# EAGLE design ESP32+PSU (EAGLE 9.6.2)
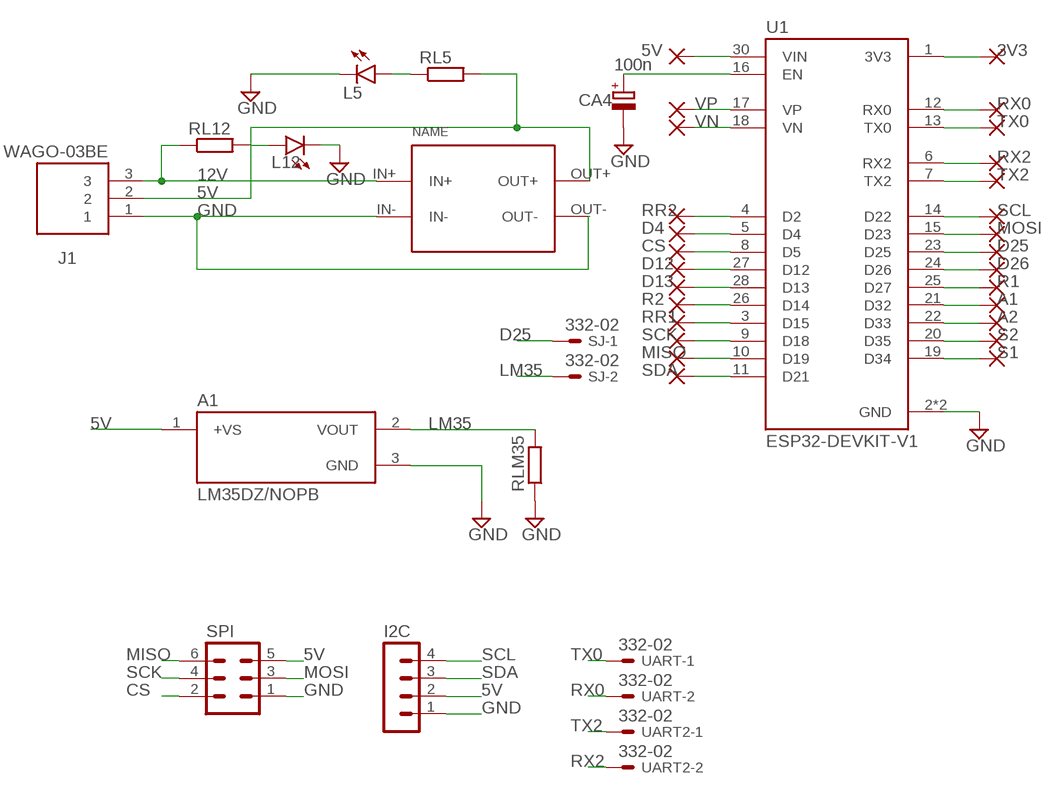
[diagram p0: schematic, sheet 1]

## Parts
A1  LM35DZ/NOPB  [TO92127P521H735-3]
CA4  100n  CPOL-EUE5-6  [E5-6]
I2C  MA04-1  [MA04-1]
J1  WAGO-03BE  [CUI_TB006-508-03BE]
L5  LED3MM  [LED3MM]
L12  LED3MM  [LED3MM]
PAD1  WIREPAD1,6/0,9  [1,6/0,9]
PAD2  WIREPAD1,6/0,9  [1,6/0,9]
PAD3  WIREPAD1,6/0,9  [1,6/0,9]
PAD4  WIREPAD1,6/0,9  [1,6/0,9]
PAD5  WIREPAD1,6/0,9  [1,6/0,9]
PAD6  WIREPAD1,6/0,9  [1,6/0,9]
PAD7  WIREPAD1,6/0,9  [1,6/0,9]
PAD8  WIREPAD1,6/0,9  [1,6/0,9]
PAD9  WIREPAD1,6/0,9  [1,6/0,9]
PAD10  WIREPAD1,6/0,9  [1,6/0,9]
PAD11  WIREPAD1,6/0,9  [1,6/0,9]
PAD12  WIREPAD1,6/0,9  [1,6/0,9]
PAD13  WIREPAD1,6/0,9  [1,6/0,9]
PAD14  WIREPAD1,6/0,9  [1,6/0,9]
PAD15  WIREPAD1,6/0,9  [1,6/0,9]
PAD16  WIREPAD1,6/0,9  [1,6/0,9]
PAD17  WIREPAD1,6/0,9  [1,6/0,9]
PAD18  WIREPAD1,6/0,9  [1,6/0,9]
PAD19  WIREPAD1,6/0,9  [1,6/0,9]
PAD20  WIREPAD1,6/0,9  [1,6/0,9]
PAD21  WIREPAD1,6/0,9  [1,6/0,9]
PAD22  WIREPAD1,6/0,9  [1,6/0,9]
PAD23  WIREPAD1,6/0,9  [1,6/0,9]
PAD24  WIREPAD1,6/0,9  [1,6/0,9]
PAD25  WIREPAD1,6/0,9  [1,6/0,9]
PAD26  WIREPAD1,6/0,9  [1,6/0,9]
PAD52  WIREPAD1,6/0,9  [1,6/0,9]
RL5  R-EU_0309/12  [0309/12]
RL12  R-EU_0309/12  [0309/12]
RLM35  R-EU_0309/12  [0309/12]
SJ  332-02  [332-02]
SPI  MA03-2  [MA03-2]
U1  ESP32-DEVKIT-V1  [MODULE_ESP32_DEVKIT_V1]
U$1  CP8-ADJ  [CP8-ADJ]
UART  332-02  [332-02]
UART2  332-02  [332-02]

## Nets
3V3: PAD11.1(P) U1.1(3V3)
5V: A1.1(+VS) I2C.2 J1.2 PAD25.1(P) RL5.2 SPI.5 U1.30(VIN) U$1.OUT+
12V: J1.3 RL12.1 U$1.IN+
A1: PAD21.1(P) U1.21(D32)
A2: PAD22.1(P) U1.22(D33)
CS: PAD3.1(P) SPI.2 U1.8(D5)
D4: PAD2.1(P) U1.5(D4)
D12: PAD4.1(P) U1.27(D12)
D13: PAD5.1(P) U1.28(D13)
D25: PAD18.1(P) SJ.1 U1.23(D25)
D26: PAD19.1(P) U1.24(D26)
GND: A1.3(GND) CA4.- I2C.1 J1.1 L5.K(C) L12.K(C) RLM35.1 SPI.1 U1.2(GND) U1.29(GND) U$1.IN- U$1.OUT-
LM35: A1.2(VOUT) RLM35.2 SJ.2
MISO: PAD9.1(P) SPI.6 U1.10(D19)
MOSI: PAD17.1(P) SPI.3 U1.15(D23)
N$14: L12.A RL12.2
N$23: L5.A RL5.1
N$25: CA4.+ U1.16(EN)
R1: PAD20.1(P) U1.25(D27)
R2: PAD6.1(P) U1.26(D14)
RR1: PAD7.1(P) U1.3(D15)
RR2: PAD1.1(P) U1.4(D2)
RX0: PAD12.1(P) U1.12(RX0) UART.2
RX2: PAD14.1(P) U1.6(RX2) UART2.2
S1: PAD24.1(P) U1.19(D34)
S2: PAD23.1(P) U1.20(D35)
SCK: PAD8.1(P) SPI.4 U1.9(D18)
SCL: I2C.4 PAD16.1(P) U1.14(D22)
SDA: I2C.3 PAD10.1(P) U1.11(D21)
TX0: PAD13.1(P) U1.13(TX0) UART.1
TX2: PAD15.1(P) U1.7(TX2) UART2.1
VN: PAD52.1(P) U1.18(VN)
VP: PAD26.1(P) U1.17(VP)

## Library data of the parts
A1 = LM35DZ_NOPB:LM35DZ/NOPB; CHECK_PRICES: https://www.snapeda.com/parts/LM35DZ/NOPB/Texas+Instruments/view-part/?ref=eda; DESCRIPTION: 1C high voltage analog temperature sensor, 10 mV/C; DIGIKEY_PART_NUMBER: LM35DZ/NOPB-ND; MF: Texas; MP: LM35DZ/NOPB; PACKAGE: None; SNAPEDA_LINK: https://www.snapeda.com/parts/LM35DZ/NOPB/Texas+Instruments/view-part/?ref=snap
CA4 = rcl-ws:CPOL-EU: POLARIZED CAPACITOR, European symbol; SPICEPREFIX: C
I2C = con-lstb:MA04-1: PIN HEADER; OC_FARNELL: unknown; OC_NEWARK: unknown
J1 = TB006-508-03BE:WAGO-03BE: Check availability <https://pricing.snapeda.com/parts/TB006-508-03BE/Same%20Sky/view-part?ref=eda>; AVAILABILITY: In Stock; CHECK_PRICES: https://www.snapeda.com/parts/TB006-508-03BE/Same+Sky/view-part/?ref=eda; DESCRIPTION: 2~24 Poles, Screw Type, Horizontal, 5.08 Pitch, 26~14 (AWG), Terminal Block Connector; MF: Same Sky; MP: TB006-508-03BE; PACKAGE: None; PRICE: None; SNAPEDA_LINK: https://www.snapeda.com/parts/TB006-508-03BE/Same+Sky/view-part/?ref=snap
L5 L12 = led_WS:LED: LED OSRAM: - CHIPLED LG R971, LG N971, LY N971, LG Q971, LY Q971, LO R971, LY R971 LH N974, LH R974 LS Q976, LO Q976, LY Q976 LO Q996 - Hyper CHIPLED LW Q18S LB Q993, LB Q99A, LB R99A - SideLED LS A670, LO A670, LY A670, LG A670, LP A670 LB A673, LV A673, LT A673, LW A673 LH A674 LY A675 LS A676, LA A676, LO A676, LY A676, LW A676 LS A679, LY A679, LG A679 - Hyper Micro SIDELED® LS Y876, LA Y876, LO Y876, LY Y876 LT Y87S - SmartLED LW L88C, LW L88S LB L89C, LB L89S, LG L890 LS L89K, LO L89K, LY L89K LS L896, LA L896, LO L896, LY L896 - TOPLED LS T670, LO T670, LY T670, LG T670, LP T670 LSG T670, LSP T670, LSY T670, LOP T670, LYG T670 LG T671, LOG T671, LSG T671 LB T673, LV T673, LT T673, LW T673 LH T674 LS T676, LA T676, LO T676, LY T676, LB T676, LH T676, LSB T676, LW T676 LB T67C, LV T67C, LT T67C, LS T67K, LO T67K, LY T67K, LW E67C LS E67B, LA E67B, LO E67B, LY E67B, LB E67C, LV E67C, LT E67C LW T67C LS T679, LY T679, LG T679 LS T770, LO T770, LY T770, LG T770, LP T770 LB T773, LV T773, LT T773, LW T773 LH T774 LS E675, LA E675, LY E675, LS T675 LS T776, LA T776, LO T776, LY T776, LB T776 LHGB T686 LT T68C, LB T68C - Hyper Mini TOPLED® LB M676 - Mini TOPLED Santana® LG M470 LS M47K, LO M47K, LY M47K Source: http://www.osram.convergy.de LUXEON: - LUMILED® LXK2-PW12-R00, LXK2-PW12-S00, LXK2-PW14-U00, LXK2-PW14-V00 LXK2-PM12-R00, LXK2-PM12-S00, LXK2-PM14-U00 LXK2-PE12-Q00, LXK2-PE12-R00, LXK2-PE12-S00, LXK2-PE14-T00, LXK2-PE14-U00 LXK2-PB12-K00, LXK2-PB12-L00, LXK2-PB12-M00, LXK2-PB14-N00, LXK2-PB14-P00, LXK2-PB14-Q00 LXK2-PR12-L00, LXK2-PR12-M00, LXK2-PR14-Q00, LXK2-PR14-R00 LXK2-PD12-Q00, LXK2-PD12-R00, LXK2-PD12-S00 LXK2-PH12-R00, LXK2-PH12-S00 LXK2-PL12-P00, LXK2-PL12-Q00, LXK2-PL12-R00 Source: www.luxeon.com KINGBRIGHT: KA-3528ASYC Source: www.kingbright.com
PAD1-PAD26 PAD52 = wirepad-ws:WIREPAD: Wire PAD connect wire on PCB
RL5 RL12 RLM35 = rcl-ws:R-EU_: RESISTOR, European symbol; SPICEPREFIX: R
SJ UART UART2 = con-garry-ws:332-02: 2 Pin - 2mm Dual Row Source: www.mpe-connector.de / garry_shortform_2012.pdf
SPI = con-lstb-ws:MA03-2: PIN HEADER; OC_FARNELL: unknown; OC_NEWARK: unknown
U1 = ESP32-DEVKIT-V1:ESP32-DEVKIT-V1: Dual core, Wi-Fi: 2.4 GHz up to 150 Mbits/s,BLE (Bluetooth Low Energy) and legacy Bluetooth, 32 bits, Up to 240 MHz Check availability <https://pricing.snapeda.com/parts/ESP32-DEVKIT-V1/Do%20it/view-part?ref=eda>; AVAILABILITY: Not in stock; CHECK_PRICES: https://www.snapeda.com/parts/ESP32-DEVKIT-V1/Do+it/view-part/?ref=eda; DESCRIPTION: Dual core, Wi-Fi: 2.4 GHz up to 150 Mbits/s,BLE (Bluetooth Low Energy) and legacy Bluetooth, 32 bits, Up to 240 MHz; MF: Do it; MP: ESP32-DEVKIT-V1; PACKAGE: None; PRICE: None; SNAPEDA_LINK: https://www.snapeda.com/parts/ESP32-DEVKIT-V1/Do+it/view-part/?ref=snap
U$1 = userlib:CP8-ADJ: Voltage regulator IN: 7-35V OUT: ADJ

## Board
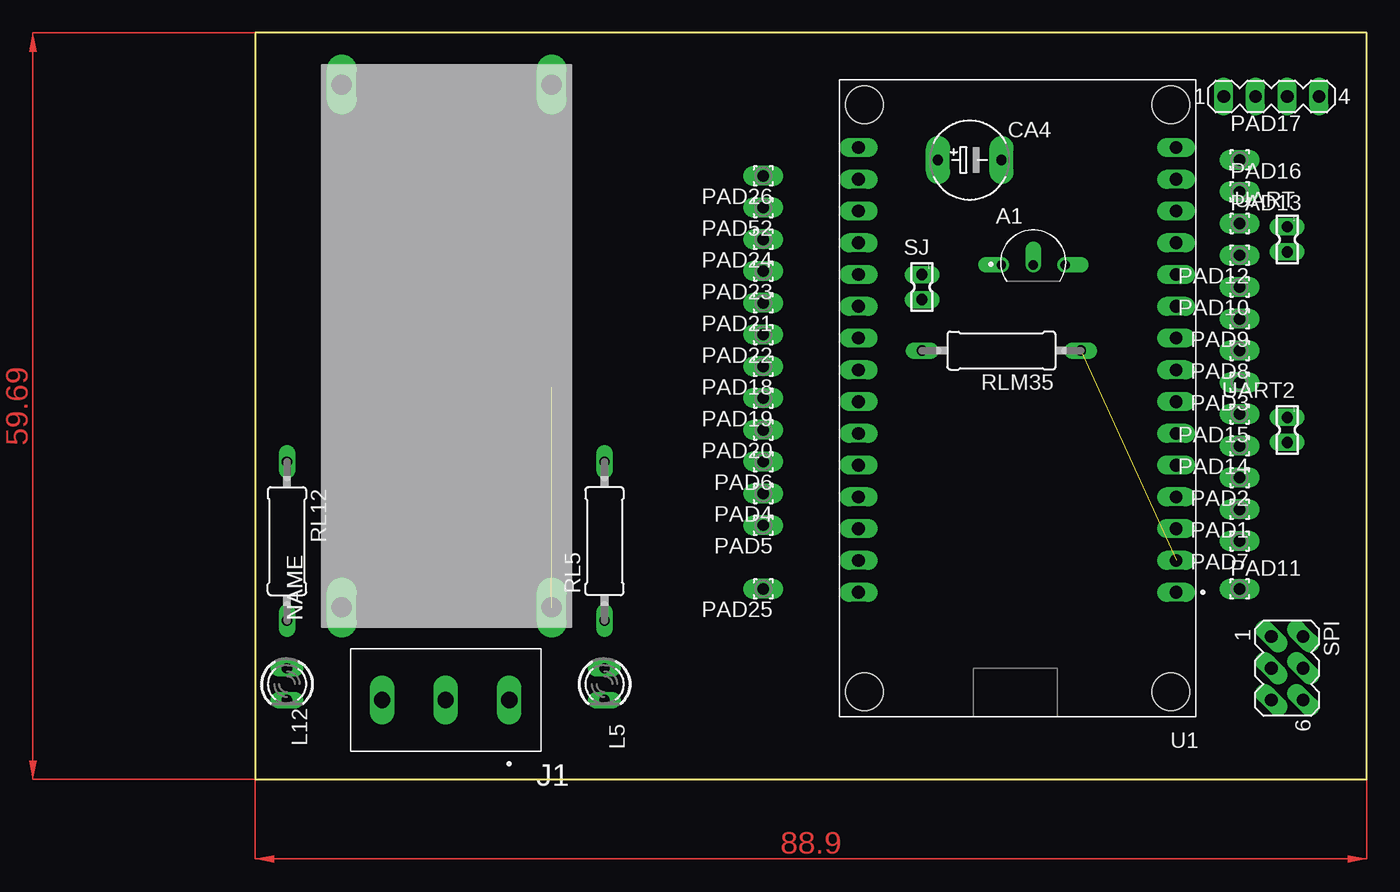
[diagram p1: board, top side]
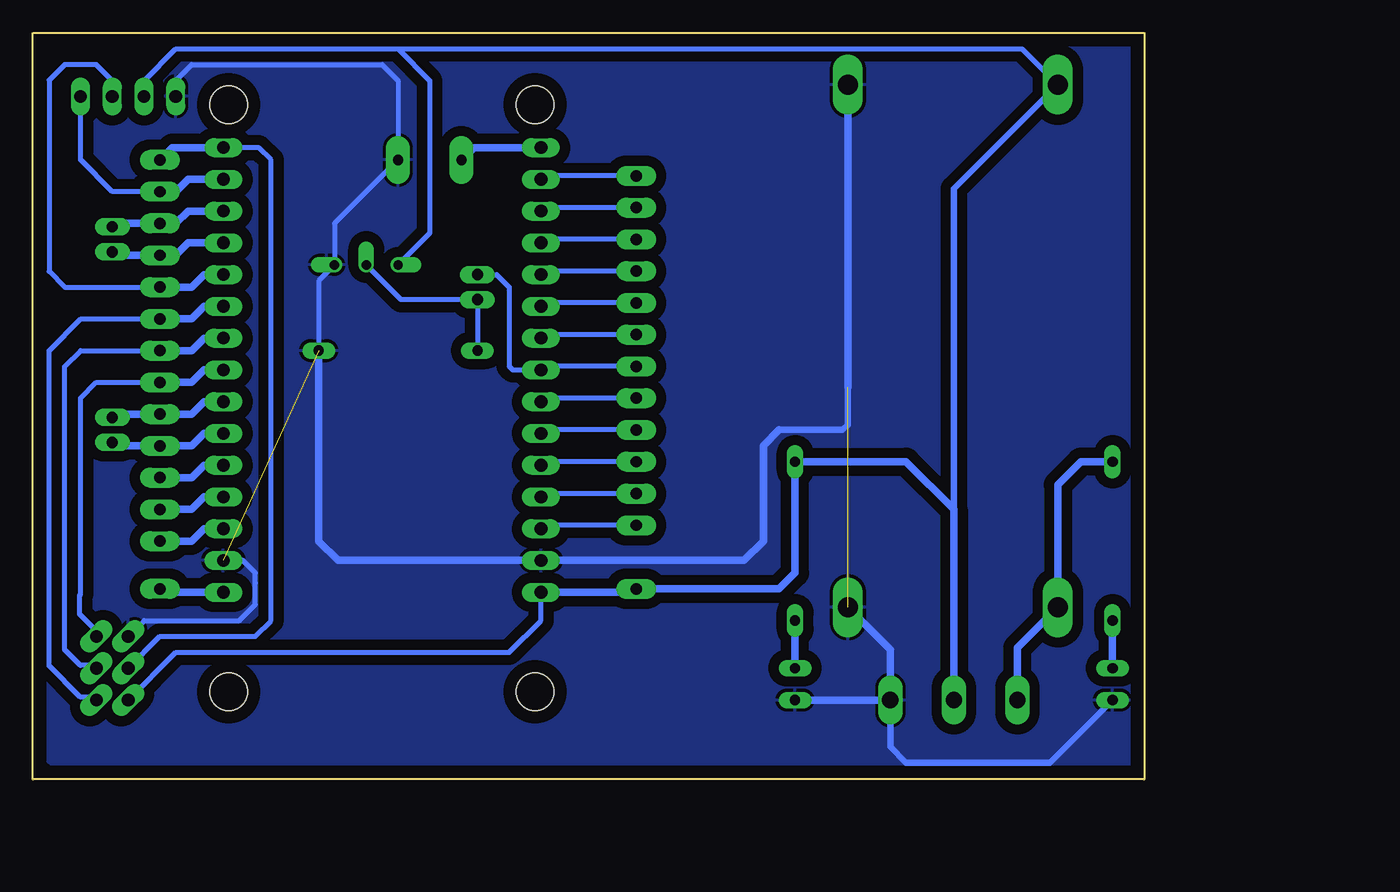
[diagram p2: board, bottom side, seen from below]

Size 88.9 x 59.69 mm. Coordinates in mm from the lower left corner, seen from the top.
Outline: 0,59.69 0,0 88.9,0 88.9,59.69 0,59.69
Copper layers (1*16): Top 0.035mm / dielectric 1.5mm / Bottom 0.035mm
Design rules "default *": minimum track width 16mil, minimum drill 0.35mm, track to track 32mil, track to pad 32mil, pad to pad 32mil, via to via 32mil, smd to smd 6mil, copper to edge 40mil, drill to drill 6mil, minimum pad ring 10mil, minimum via ring 8mil, stop-mask expansion 4mil, vias tented up to drill 0mil, thermal gap 10mil

### Footprints (pad centres in the part's own frame; a part is rotated, then mirrored left to right if it is on the bottom)
TO92127P521H735-3 = drill 0.75 pad 0.813 offset: 1 -2.54,-0.775; 2 0,-0.775; 3 2.54,-0.775
E5-6 = drill 0.813 pad 1.905 long: + -2.54,0; - 2.54,0
MA04-1 = drill 1.016 long: 1 -3.81,0; 2 -1.27,0; 3 1.27,0; 4 3.81,0
CUI_TB006-508-03BE = drill 1.3 long: 1 0,0; 2 5.08,0; 3 10.16,0
LED3MM = drill 0.813 long: A -1.27,0; K 1.27,0
1,6/0,9 = drill 0.914 pad 1.6 long: 1 0,0
0309/12 = drill 0.813 long: 1 -6.35,0; 2 6.35,0
332-02 = drill 0.9 pad 1.016 long: 1 0,-1; 2 0,1
MA03-2 = drill 1.016 pad 1.016 long: 1 -2.54,-1.27; 2 -2.54,1.27; 3 0,-1.27; 4 0,1.27; 5 2.54,-1.27; 6 2.54,1.27
MODULE_ESP32_DEVKIT_V1 = drill 1.02 pad 1.27 long: 1 -12.7,15.515; 2 -12.7,12.975; 3 -12.7,10.435; 4 -12.7,7.895; 5 -12.7,5.355; 6 -12.7,2.815; 7 -12.7,0.275; 8 -12.7,-2.265; 9 -12.7,-4.805; 10 -12.7,-7.345; 11 -12.7,-9.885; 12 -12.7,-12.425; 13 -12.7,-14.965; 14 -12.7,-17.505; 15 -12.7,-20.045; 16 12.7,-20.045; 17 12.7,-17.505; 18 12.7,-14.965; 19 12.7,-12.425; 20 12.7,-9.885; 21 12.7,-7.345; 22 12.7,-4.805; 23 12.7,-2.265; 24 12.7,0.275; 25 12.7,2.815; 26 12.7,5.355; 27 12.7,7.895; 28 12.7,10.435; 29 12.7,12.975; 30 12.7,15.515 | hole 3: -12.28,-23.475; 12.23,-23.475; 12.23,23.475; -12.28,23.475
CP8-ADJ = drill 1.6 long: IN+ -21.81,7.05; IN- -21.81,-9.75; OUT+ 19.99,7.05; OUT- 19.99,-9.75

### Placement (x,y rotation side)
A1  62.23,41.91 0 top
CA4  57.15,49.53 0 top
I2C  81.28,54.61 0 top
J1  20.32,6.35 180 top
L5  27.94,7.62 270 top
L12  2.54,7.62 270 top
PAD1  78.74,21.59 180 top
PAD2  78.74,24.13 180 top
PAD3  78.74,31.75 180 top
PAD4  40.64,22.86 180 top
PAD5  40.64,20.32 180 top
PAD6  40.64,25.4 180 top
PAD7  78.74,19.05 180 top
PAD8  78.74,34.29 180 top
PAD9  78.74,36.83 180 top
PAD10  78.74,39.37 180 top
PAD11  78.74,15.24 0 top
PAD12  78.74,41.91 180 top
PAD13  78.74,44.45 0 top
PAD14  78.74,26.67 180 top
PAD15  78.74,29.21 180 top
PAD16  78.74,46.99 0 top
PAD17  78.74,49.53 0 top
PAD18  40.64,33.02 180 top
PAD19  40.64,30.48 180 top
PAD20  40.64,27.94 180 top
PAD21  40.64,38.1 180 top
PAD22  40.64,35.56 180 top
PAD23  40.64,40.64 180 top
PAD24  40.64,43.18 180 top
PAD25  40.64,15.24 180 top
PAD26  40.64,48.26 180 top
PAD52  40.64,45.72 180 top
RL5  27.94,19.05 90 top
RL12  2.54,19.05 270 top
RLM35  59.69,34.29 180 top
SJ  53.34,39.37 180 top
SPI  82.55,8.89 270 top
U1  60.96,30.48 180 top
U$1  13.97,35.56 90 top
UART  82.55,43.18 180 top
UART2  82.55,27.94 180 top

### Tracks (layer width: path | path; a pad name or v marks a point on that pad's centre or on a via)
3V3
  Bottom 0.61: U1.1 78.47,14.96 PAD11.1
5V
  Bottom 0.406: SPI.5 77.47,10.16 50.8,10.16 48.26,12.7 U1.30 | I2C.2 80.01,55.88 77.47,58.42 59.69,58.42 | 59.69,58.42 57.15,55.88 57.15,43.67 A1.1 | 59.69,58.42 9.79,58.42 U$1.OUT+
  Bottom 0.508: U$1.OUT+ 15.24,47.23 15.24,21.59
  Bottom 0.61: U1.30 40.91,14.96 PAD25.1 29.21,15.24 27.94,16.51 RL5.2 19.05,25.4 15.24,21.59 J1.2
12V
  Bottom 0.61: J1.3 10.16,10.51 U$1.IN+ 6.92,23.56 5.08,25.4 RL12.1
A1
  Bottom 0.406: PAD21.1 48.26,38.1 U1.21
A2
  Bottom 0.406: PAD22.1 47.98,35.56 U1.22
CS
  Bottom 0.406: SPI.2 83.82,11.87 85.17,13.22 85.17,14.72 85.09,14.8 85.09,30.48 83.82,31.75 PAD3.1
  Bottom 0.61: U1.8 75.2,32.74 76.2,31.75 PAD3.1
D4
  Bottom 0.61: U1.5 75.2,25.12 76.2,24.13 PAD2.1
D12
  Bottom 0.406: PAD4.1 47.98,22.86 U1.27
D13
  Bottom 0.406: PAD5.1 47.98,20.32 U1.28
D25
  Bottom 0.406: SJ.1 51.8,40.37 50.8,39.37 50.8,38.57 50.81,38.56 50.81,34.55 50.8,34.54 50.8,33.02 50.52,32.74 U1.23 47.98,33.02 PAD18.1
D26
  Bottom 0.406: PAD19.1 47.98,30.48 U1.24
GND  (2 unrouted)
  Bottom 0.406: SPI.1 80.01,12.7 72.39,12.7 71.11,13.98 71.11,15.7 71.12,15.71 71.12,16.51 72.11,17.5 U1.2 | 65.79,34.29 RLM35.1 66.04,39.87 A1.3 64.77,44.45 CA4.- 59.69,55.88 60.96,57.15 76.2,57.15 77.47,55.88 I2C.1
  Bottom 0.508: L12.K 7.54,1.35 19.05,1.35 20.32,2.62 J1.1 | 23.72,31.75 23.72,28.35 24.13,27.94 29.21,27.94
  Bottom 0.61: U$1.IN- 20.32,10.35 J1.1 L5.K | 29.21,27.94 30.48,26.67 30.48,19.05 32.02,17.5 U1.29 64.5,17.5 66.04,19.05 RLM35.1 | U$1.OUT- 23.72,31.75 23.72,31.34
  pour Bottom: 1.27,59.69 87.63,59.69 88.9,58.42 88.9,2.54 86.36,0 1.27,0 0,1.27 0,58.42
LM35
  Bottom 0.406: RLM35.2 SJ.2 59.47,38.37 A1.2
MISO
  Bottom 0.406: SPI.6 84.04,6.57 85.09,6.57 87.61,9.08 87.61,34.29 85.06,36.83 PAD9.1
  Bottom 0.61: U1.10 75.2,37.83 76.2,36.83 PAD9.1
MOSI
  Bottom 0.406: SPI.3 78.74,11.43 71.12,11.43 69.85,12.7 69.85,49.53 70.84,50.52 U1.15
  Bottom 0.61: U1.15 77.75,50.52 PAD17.1
N$14
  Bottom 0.61: RL12.2 L12.A
N$23
  Bottom 0.61: L5.A RL5.1
N$25
  Bottom 0.61: U1.16 53.62,50.52 CA4.+
R1
  Bottom 0.406: PAD20.1 47.98,27.94 U1.25
R2
  Bottom 0.406: PAD6.1 47.98,25.4 U1.26
RR1
  Bottom 0.61: U1.3 75.2,20.05 76.2,19.05 PAD7.1
RR2
  Bottom 0.61: U1.4 75.2,22.59 76.2,21.59 PAD1.1
RX0
  Bottom 0.61: UART.2 82.28,41.91 PAD12.1 77.47,41.91 76.47,42.91 U1.12
RX2
  Bottom 0.61: UART2.2 82.28,26.67 80.01,26.67 PAD14.1 76.2,26.67 75.2,27.66 U1.6
S1
  Bottom 0.406: PAD24.1 47.98,43.18 U1.19
S2
  Bottom 0.406: PAD23.1 47.98,40.64 U1.20
SCK
  Bottom 0.406: SPI.4 84.04,9.11 85.09,9.11 86.36,10.38 86.36,33.02 85.09,34.29 PAD8.1
  Bottom 0.61: U1.9 75.2,35.28 76.2,34.29 PAD8.1
SCL
  Bottom 0.406: PAD16.1 82.55,46.99 85.09,49.53 I2C.4
  Bottom 0.61: U1.14 76.47,47.98 77.47,46.99 PAD16.1
SDA
  Bottom 0.406: I2C.3 82.55,55.88 83.82,57.15 86.36,57.15 87.61,55.91 87.61,40.62 86.36,39.37 PAD10.1
  Bottom 0.61: U1.11 75.2,40.37 76.2,39.37 PAD10.1
TX0
  Bottom 0.61: U1.13 76.47,45.45 77.47,44.45 PAD13.1 82.28,44.45 UART.1
TX2
  Bottom 0.406: UART2.1 82.55,28.66
  Bottom 0.61: U1.7 75.2,30.2 76.2,29.21 PAD15.1 82.28,29.21 UART2.1
VN
  Bottom 0.406: PAD52.1 47.98,45.72 U1.18
VP
  Bottom 0.406: PAD26.1 47.98,48.26 U1.17
(copper drawn outside any net)
  shapes: Top area x2